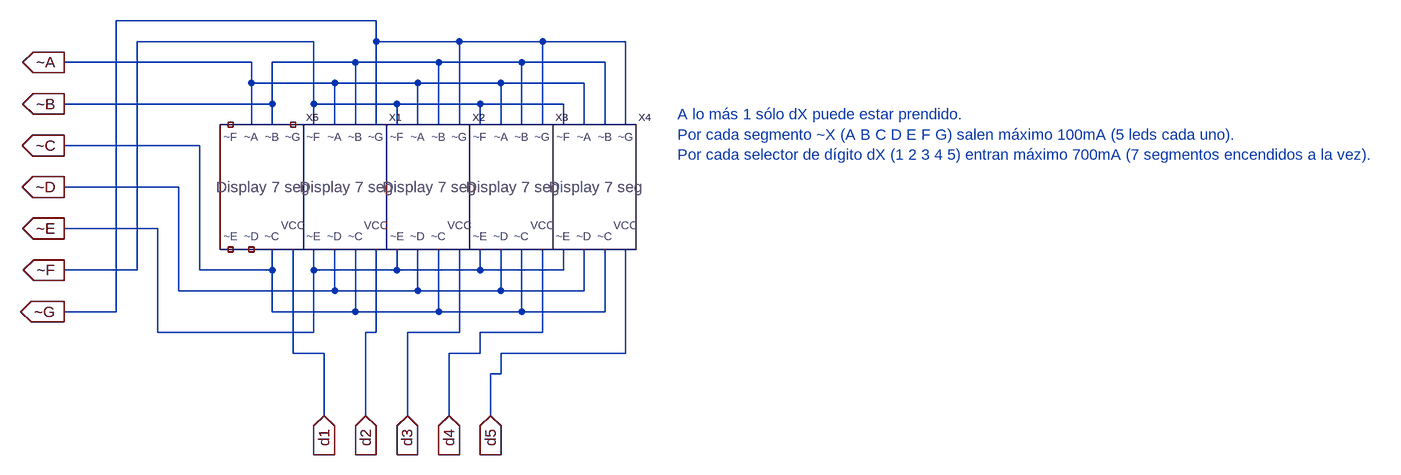
[diagram p0: schematic Display 5 dígitos.asc]
Display 5 dígitos.asc, the LTspice schematic file:
Version 4
SHEET 1 1884 680
WIRE 144 -64 -256 -64
WIRE 48 -32 -224 -32
WIRE 144 -32 144 -64
WIRE 272 -32 144 -32
WIRE 400 -32 272 -32
WIRE 528 -32 400 -32
WIRE -48 0 -336 0
WIRE 112 0 -16 0
WIRE 240 0 112 0
WIRE 368 0 240 0
WIRE 496 0 368 0
WIRE -48 32 -48 0
WIRE 80 32 -48 32
WIRE 208 32 80 32
WIRE 336 32 208 32
WIRE 464 32 336 32
WIRE -16 64 -16 0
WIRE -16 64 -336 64
WIRE 48 64 48 -32
WIRE 176 64 48 64
WIRE 304 64 176 64
WIRE 432 64 304 64
WIRE -48 96 -48 32
WIRE -16 96 -16 64
WIRE 48 96 48 64
WIRE 80 96 80 32
WIRE 112 96 112 0
WIRE 144 96 144 -32
WIRE 176 96 176 64
WIRE 208 96 208 32
WIRE 240 96 240 0
WIRE 272 96 272 -32
WIRE 304 96 304 64
WIRE 336 96 336 32
WIRE 368 96 368 0
WIRE 400 96 400 -32
WIRE 432 96 432 64
WIRE 464 96 464 32
WIRE 496 96 496 0
WIRE 528 96 528 -32
WIRE -128 128 -336 128
WIRE -160 192 -336 192
WIRE -192 256 -336 256
WIRE -224 320 -224 -32
WIRE -224 320 -336 320
WIRE -128 320 -128 128
WIRE -16 320 -16 288
WIRE -16 320 -128 320
WIRE 48 320 48 288
WIRE 176 320 176 288
WIRE 176 320 48 320
WIRE 304 320 304 288
WIRE 304 320 176 320
WIRE 432 320 432 288
WIRE 432 320 304 320
WIRE -160 352 -160 192
WIRE 80 352 80 288
WIRE 80 352 -160 352
WIRE 208 352 208 288
WIRE 208 352 80 352
WIRE 336 352 336 288
WIRE 336 352 208 352
WIRE 464 352 464 288
WIRE 464 352 336 352
WIRE -256 384 -256 -64
WIRE -256 384 -336 384
WIRE -16 384 -16 320
WIRE 112 384 112 288
WIRE 112 384 -16 384
WIRE 240 384 240 288
WIRE 240 384 112 384
WIRE 368 384 368 288
WIRE 368 384 240 384
WIRE 496 384 496 288
WIRE 496 384 368 384
WIRE -192 416 -192 256
WIRE 48 416 48 320
WIRE 48 416 -192 416
WIRE 144 416 144 288
WIRE 144 416 128 416
WIRE 272 416 272 288
WIRE 272 416 192 416
WIRE 400 416 400 288
WIRE 400 416 304 416
WIRE 16 448 16 288
WIRE 64 448 16 448
WIRE 304 448 304 416
WIRE 304 448 256 448
WIRE 528 448 528 288
WIRE 528 448 336 448
WIRE 336 480 336 448
WIRE 336 480 320 480
WIRE 64 544 64 448
WIRE 128 544 128 416
WIRE 192 544 192 416
WIRE 256 544 256 448
WIRE 320 544 320 480
FLAG -336 0 ~A
IOPIN -336 0 Out
FLAG -336 64 ~B
IOPIN -336 64 Out
FLAG -336 128 ~C
IOPIN -336 128 Out
FLAG -336 192 ~D
IOPIN -336 192 Out
FLAG -336 256 ~E
IOPIN -336 256 Out
FLAG -336 320 ~F
IOPIN -336 320 Out
FLAG -336 384 ~G
IOPIN -336 384 Out
FLAG 64 544 d1
IOPIN 64 544 In
FLAG 128 544 d2
IOPIN 128 544 In
FLAG 192 544 d3
IOPIN 192 544 In
FLAG 256 544 d4
IOPIN 256 544 In
FLAG 320 544 d5
IOPIN 320 544 In
SYMBOL Display\ 7\ seg 96 160 R0
SYMATTR InstName X1
SYMBOL Display\ 7\ seg 224 160 R0
SYMATTR InstName X2
SYMBOL Display\ 7\ seg 352 160 R0
SYMATTR InstName X3
SYMBOL Display\ 7\ seg 480 160 R0
SYMATTR InstName X4
SYMBOL Display\ 7\ seg -32 160 R0
SYMATTR InstName X5
TEXT 608 80 Left 2 ;A lo más 1 sólo dX puede estar prendido.\nPor cada segmento ~X (A B C D E F G) salen máximo 100mA (5 leds cada uno).\nPor cada selector de dígito dX (1 2 3 4 5) entran máximo 700mA (7 segmentos encendidos a la vez).

The netlist it stands for:
* Display 5 dígitos.asc
XX1 ~F ~A ~B ~G ~E ~D ~C d2 Display 7 seg  ; pins ~F ~A ~B ~G ~E ~D ~C VCC
XX2 ~F ~A ~B ~G ~E ~D ~C d3 Display 7 seg  ; pins ~F ~A ~B ~G ~E ~D ~C VCC
XX3 ~F ~A ~B ~G ~E ~D ~C d4 Display 7 seg  ; pins ~F ~A ~B ~G ~E ~D ~C VCC
XX4 ~F ~A ~B ~G ~E ~D ~C d5 Display 7 seg  ; pins ~F ~A ~B ~G ~E ~D ~C VCC
XX5 NC_01 ~A ~B NC_02 NC_03 NC_04 ~C d1 Display 7 seg  ; pins ~F ~A ~B ~G ~E ~D ~C VCC
* A lo más 1 sólo dX puede estar prendido.
* Por cada segmento ~X (A B C D E F G) salen máximo 100mA (5 leds cada uno).
* Por cada selector de dígito dX (1 2 3 4 5) entran máximo 700mA (7 segmentos encendidos a la vez).
.backanno
.end